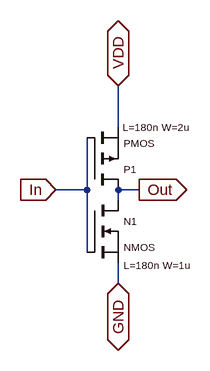
[diagram p0: schematic CMOS_Inveter.asc]
CMOS_Inveter.asc, the LTspice schematic file:
Version 4.1
SHEET 1 880 680
WIRE -112 -32 -112 -96
WIRE -160 64 -160 -16
WIRE -160 64 -208 64
WIRE -80 64 -112 64
WIRE -112 80 -112 64
WIRE -160 160 -160 64
WIRE -112 208 -112 176
FLAG -80 64 Out
IOPIN -80 64 Out
FLAG -208 64 In
IOPIN -208 64 In
FLAG -112 -96 VDD
IOPIN -112 -96 BiDir
FLAG -112 208 GND
IOPIN -112 208 BiDir
SYMBOL nmos -160 80 R0
WINDOW 0 56 32 Left 1
WINDOW 3 56 72 Left 1
WINDOW 123 56 100 Left 1
SYMATTR InstName N1
SYMATTR Value2 L=180n W=1u
SYMBOL pmos -160 64 M180
WINDOW 0 56 32 Left 1
WINDOW 3 56 72 Left 1
WINDOW 123 55 96 Left 1
SYMATTR InstName P1
SYMATTR Value2 L=180n W=2u

The netlist it stands for:
* CMOS_Inveter.asc
M§N1 Out In GND GND NMOS L=180n W=1u
M§P1 Out In VDD VDD PMOS L=180n W=2u
.model NMOS NMOS
.model PMOS PMOS
.lib standard.mos
.backanno
.end